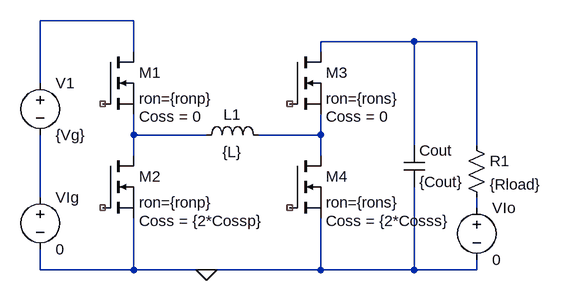
[diagram p0: schematic BB_4sw.asc]
BB_4sw.asc, the LTspice schematic file:
Version 4
SHEET 1 1108 708
WIRE 272 144 128 144
WIRE 704 176 560 176
WIRE 800 176 704 176
WIRE 272 192 272 144
WIRE 560 192 560 176
WIRE 128 240 128 144
WIRE 272 320 272 288
WIRE 384 320 272 320
WIRE 560 320 560 288
WIRE 560 320 464 320
WIRE 704 336 704 176
WIRE 800 336 800 176
WIRE 272 352 272 320
WIRE 560 352 560 320
WIRE 128 416 128 320
WIRE 800 432 800 416
WIRE 128 528 128 496
WIRE 272 528 272 448
WIRE 272 528 128 528
WIRE 384 528 272 528
WIRE 560 528 560 448
WIRE 560 528 384 528
WIRE 704 528 704 400
WIRE 704 528 560 528
WIRE 800 528 800 512
WIRE 800 528 704 528
FLAG 384 528 0
SYMBOL nmos 224 192 R0
WINDOW 123 56 100 Left 2
SYMATTR Value2 Coss = 0
SYMATTR InstName M1
SYMATTR Value ron={ronp}
SYMBOL nmos 224 352 R0
WINDOW 123 56 100 Left 2
SYMATTR Value2 Coss = {2*Cossp}
SYMATTR InstName M2
SYMATTR Value ron={ronp}
SYMBOL ind 368 336 R270
WINDOW 0 32 56 VTop 2
WINDOW 3 5 56 VBottom 2
SYMATTR InstName L1
SYMATTR Value {L}
SYMBOL nmos 512 192 R0
WINDOW 123 56 100 Left 2
SYMATTR Value2 Coss = 0
SYMATTR InstName M3
SYMATTR Value ron={rons}
SYMBOL nmos 512 352 R0
WINDOW 123 56 100 Left 2
SYMATTR Value2 Coss = {2*Cosss}
SYMATTR InstName M4
SYMATTR Value ron={rons}
SYMBOL voltage 128 224 R0
WINDOW 123 0 0 Left 0
WINDOW 39 0 0 Left 0
SYMATTR InstName V1
SYMATTR Value {Vg}
SYMBOL cap 688 336 R0
SYMATTR InstName Cout
SYMATTR Value {Cout}
SYMBOL res 784 320 R0
SYMATTR InstName R1
SYMATTR Value {Rload}
SYMBOL voltage 128 400 R0
WINDOW 123 0 0 Left 0
WINDOW 39 0 0 Left 0
SYMATTR InstName VIg
SYMATTR Value 0
SYMBOL voltage 800 416 R0
WINDOW 123 0 0 Left 0
WINDOW 39 0 0 Left 0
SYMATTR InstName VIo
SYMATTR Value 0

The netlist it stands for:
* BB_4sw.asc
M1 N001 NC_01 N003 N003 ron={ronp} Coss = 0
M2 N003 NC_02 0 0 ron={ronp} Coss = {2*Cossp}
L1 N003 N004 {L}
M3 N002 NC_03 N004 N004 ron={rons} Coss = 0
M4 N004 NC_04 0 0 ron={rons} Coss = {2*Cosss}
V1 N001 N005 {Vg}
Cout N002 0 {Cout}
R1 N002 N006 {Rload}
VIg N005 0 0
VIo N006 0 0
.model NMOS NMOS
.model PMOS PMOS
.lib standard.mos
.backanno
.end